# Altium schematic sheet STM32.SchDoc
size A4; SheetNumber: 5; SheetTotal: 5
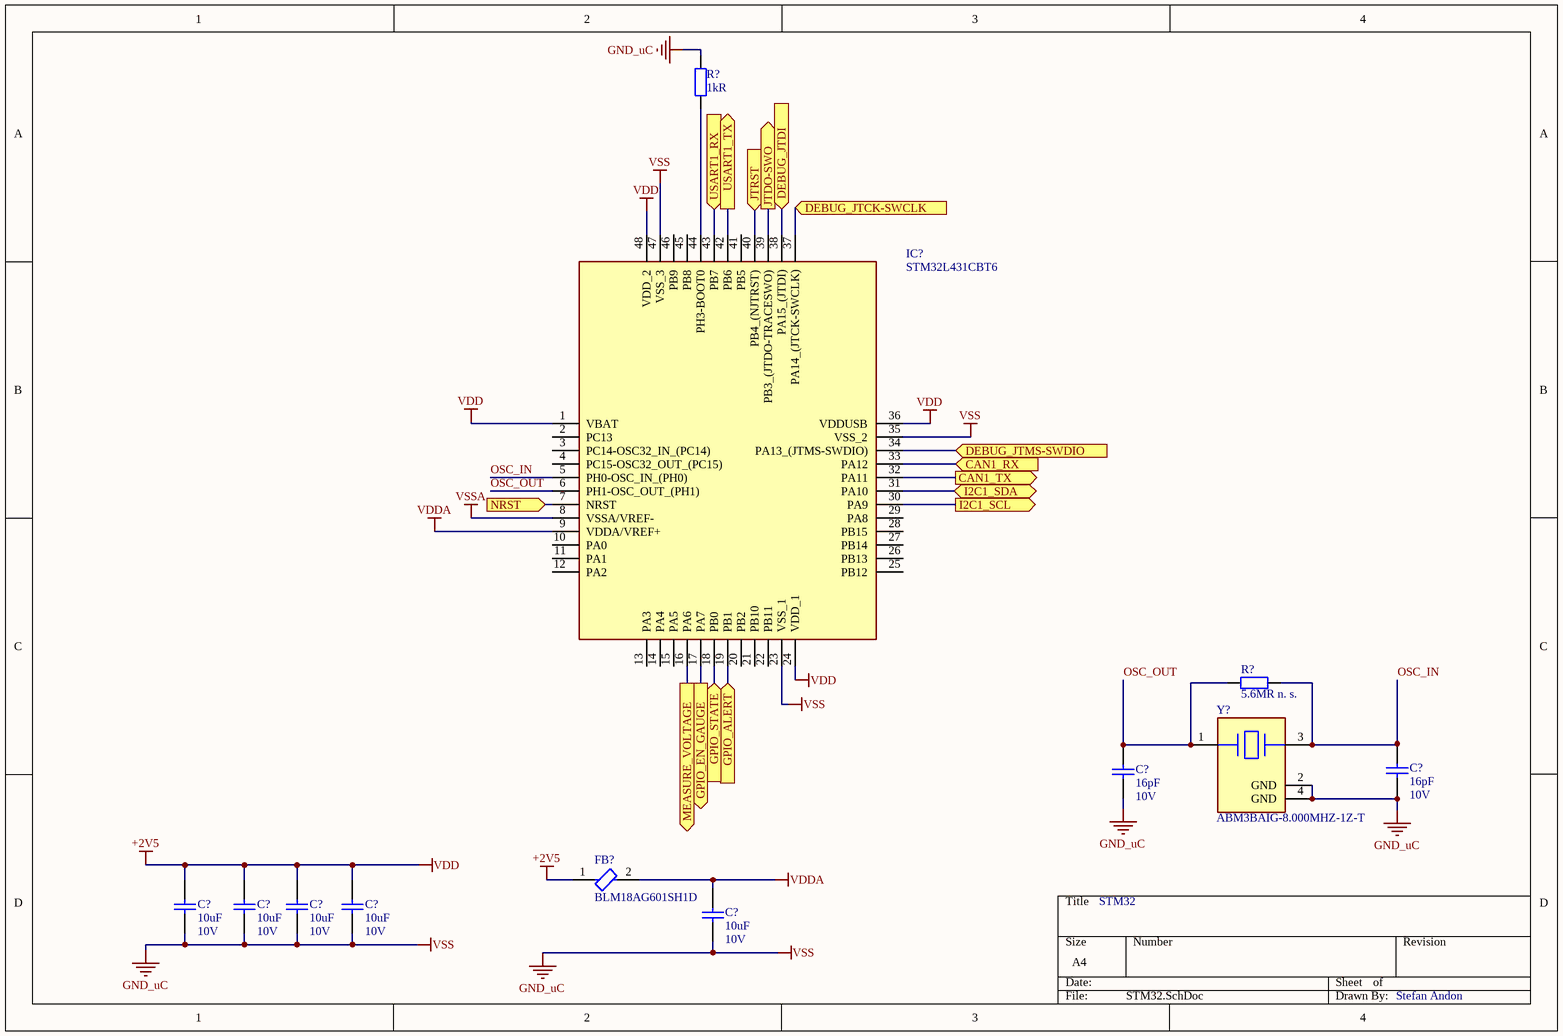
[diagram p0: STM32.SchDoc]

## Parts
(Parts that share a designator on the sheet are numbered #1, #2 ... from top to bottom, then left to right.)
C?#1  value 16pF  Voltage: 10V  [CAP_0603]  (hidden comment: Capacitor_SMD)
C?#2  value 16pF  Voltage: 10V  [CAP_0603]  (hidden comment: Capacitor_SMD)
C?#3  value 10uF  Voltage: 10V  [CAP_0603]  (hidden comment: Capacitor_SMD)
C?#4  value 10uF  Voltage: 10V  [CAP_0603]  (hidden comment: Capacitor_SMD)
C?#5  value 10uF  Voltage: 10V  [CAP_0603]  (hidden comment: Capacitor_SMD)
C?#6  value 10uF  Voltage: 10V  [CAP_0603]  (hidden comment: Capacitor_SMD)
C?#7  value 10uF  Voltage: 10V  [CAP_0603]  (hidden comment: Capacitor_SMD)
FB?  BLM18AG601SH1D  [FP-BLM18-0_15-t0_8-MFG]
IC?  STM32L431CBT6  [QFP50P900X900X160-48N]
R?#1  value 1kR  [RES_1206]  (hidden comment: Resistor_SMD)
R?#2  value 5.6MR n. s.  [RES_1206]  (hidden comment: Resistor_SMD)
Y?  ABM3BAIG-8.000MHZ-1Z-T  [FP-ABM3BAIG-MFG]

## Ports
CAN1_RX (in), CAN1_TX (out), DEBUG_JTCK-SWCLK (in), DEBUG_JTDI (in), DEBUG_JTMS-SWDIO (in), GPIO_ALERT (in), GPIO_EN_GAUGE (out), GPIO_STATE (in), I2C1_SCL (out), I2C1_SDA (bidir), JTDO-SWO (out), JTRST (in), MEASURE_VOLTAGE (out), NRST (in), USART1_RX (in), USART1_TX (out)

## Nets
+2V5: C?#3.1 C?#4.1 C?#5.1 C?#6.1 FB?.1 IC?.1(VBAT) IC?.24(VDD_1) IC?.36(VDDUSB) IC?.48(VDD_2)  [also labelled VDD]
GND_uC: C?#1.2 C?#2.2 C?#3.2 C?#4.2 C?#5.2 C?#6.2 C?#7.2 IC?.23(VSS_1) IC?.35(VSS_2) IC?.47(VSS_3) R?#1.1 Y?.2(GND) Y?.4(GND)  [also labelled VSS]
VDDA: C?#7.1 FB?.2 IC?.9(VDDA/VREF+)
VSSA: IC?.8(VSSA/VREF-)
CAN1_RX: IC?.33(PA12) ; port CAN1_RX
CAN1_TX: IC?.32(PA11) ; port CAN1_TX
DEBUG_JTCK-SWCLK: IC?.37(PA14_(JTCK-SWCLK)) ; port DEBUG_JTCK-SWCLK
DEBUG_JTDI: IC?.38(PA15_(JTDI)) ; port DEBUG_JTDI
DEBUG_JTMS-SWDIO: IC?.34(PA13_(JTMS-SWDIO)) ; port DEBUG_JTMS-SWDIO
GPIO_ALERT: IC?.19(PB1) ; port GPIO_ALERT
GPIO_EN_GAUGE: IC?.17(PA7) ; port GPIO_EN_GAUGE
GPIO_STATE: IC?.18(PB0) ; port GPIO_STATE
I2C1_SCL: IC?.30(PA9) ; port I2C1_SCL
I2C1_SDA: IC?.31(PA10) ; port I2C1_SDA
JTDO-SWO: IC?.39(PB3_(JTDO-TRACESWO)) ; port JTDO-SWO
JTRST: IC?.40(PB4_(NJTRST)) ; port JTRST
MEASURE_VOLTAGE: IC?.16(PA6) ; port MEASURE_VOLTAGE
NRST: IC?.7(NRST) ; port NRST
OSC_IN: C?#1.1 IC?.5(PH0-OSC_IN_(PH0)) R?#2.1 Y?.3
OSC_OUT: C?#2.1 IC?.6(PH1-OSC_OUT_(PH1)) R?#2.2 Y?.1
USART1_RX: IC?.43(PB7) ; port USART1_RX
USART1_TX: IC?.42(PB6) ; port USART1_TX
NetIC?_44: IC?.44(PH3-BOOT0) R?#1.2

Not connected (* = marked no-connect by the designer): IC? 2(PC13) 3(PC14-OSC32_IN_(PC14)) 4(PC15-OSC32_OUT_(PC15)) 10(PA0) 11(PA1) 12(PA2) 13(PA3) 14(PA4) 15(PA5) 20(PB2) 21(PB10) 22(PB11) 25(PB12) 26(PB13) 27(PB14) 28(PB15) 29(PA8) 41(PB5) 45(PB8) 46(PB9)

## Notes on the sheet
- STM32
- Stefan Andon

## Library data of the parts
C?#1 C?#2 = CMP-001-0004-13: SMD Capacitor; Tolerance: tbd; BOM: 16pF, 10V, tbd, tbd,CAP_0603; Dielectric: tbd; Package: tbd
C?#3-C?#7 = CMP-001-0004-13: SMD Capacitor; Tolerance: tbd; BOM: 10uF, 10V, tbd, tbd,CAP_0603; Dielectric: tbd; Package: tbd
FB? = CMP-2000-05953-2: Chip Ferrite Bead, 0603, 600Ω @ 100MHz, 0.38Ω, 25%, 500mA; Current Rating: 200mA; Impedance: 600R; Number of Lines: 1; DC Resistance (DCR): 380mR; Shielding: Unshielded; Material: Steel; Case Code (Metric): 1608; Radiation Hardening: No; Mount: Surface Mount; Series: EMIFIL®, BLM18A; Package Quantity: 4000; Length: 1.6mm; Depth: 0.8mm; Max Operating Temperature: 125°C; RoHS Compliant: Yes; Case/Package: 0603; Max DC Current: 200mA; Lead Free: Lead Free; Min Operating Temperature: -55°C; Packaging: Tape and Reel; Case Code (Imperial): 0603; Test Frequency: 100MHz; Termination: Flat; Number of Circuits: 1; Height: 0.8mm; Tolerance: 25%; Max Current Rating: 500mA; Contact Plating: Tin; Width: 0.8mm; Ratings: AEC-Q200
IC? = STM32L431CBT6: Integrated Circuit; Manufacturer_Name: STMicroelectronics; Datasheet Link: https://www.st.com/resource/en/datasheet/stm32l431cb.pdf; Height: 1.6mm; Manufacturer_Part_Number: STM32L431CBT6; Mouser Part Number: 511-STM32L431CBT6; Mouser Price/Stock: https://www.mouser.co.uk/ProductDetail/STMicroelectronics/STM32L431CBT6?qs=U58vgkJzipQlQfAJeHTS0w%3D%3D; Arrow Part Number: STM32L431CBT6; Arrow Price/Stock: https://www.arrow.com/en/products/stm32l431cbt6/stmicroelectronics?utm_currency=USD&region=nac
R?#1 R?#2 = CMP-001-0003-18: Tolerance: tbd; Power: 7W; BOM: Value+', '+Power+', '+Tolerance+', '+CurrentFootprint; Package: tbd
Y? = CMP-27762-004085-1: CRYSTAL 8.0000MHZ 18PF SMD